# EAGLE design CRT_Control_Board (EAGLE 9.6.2)
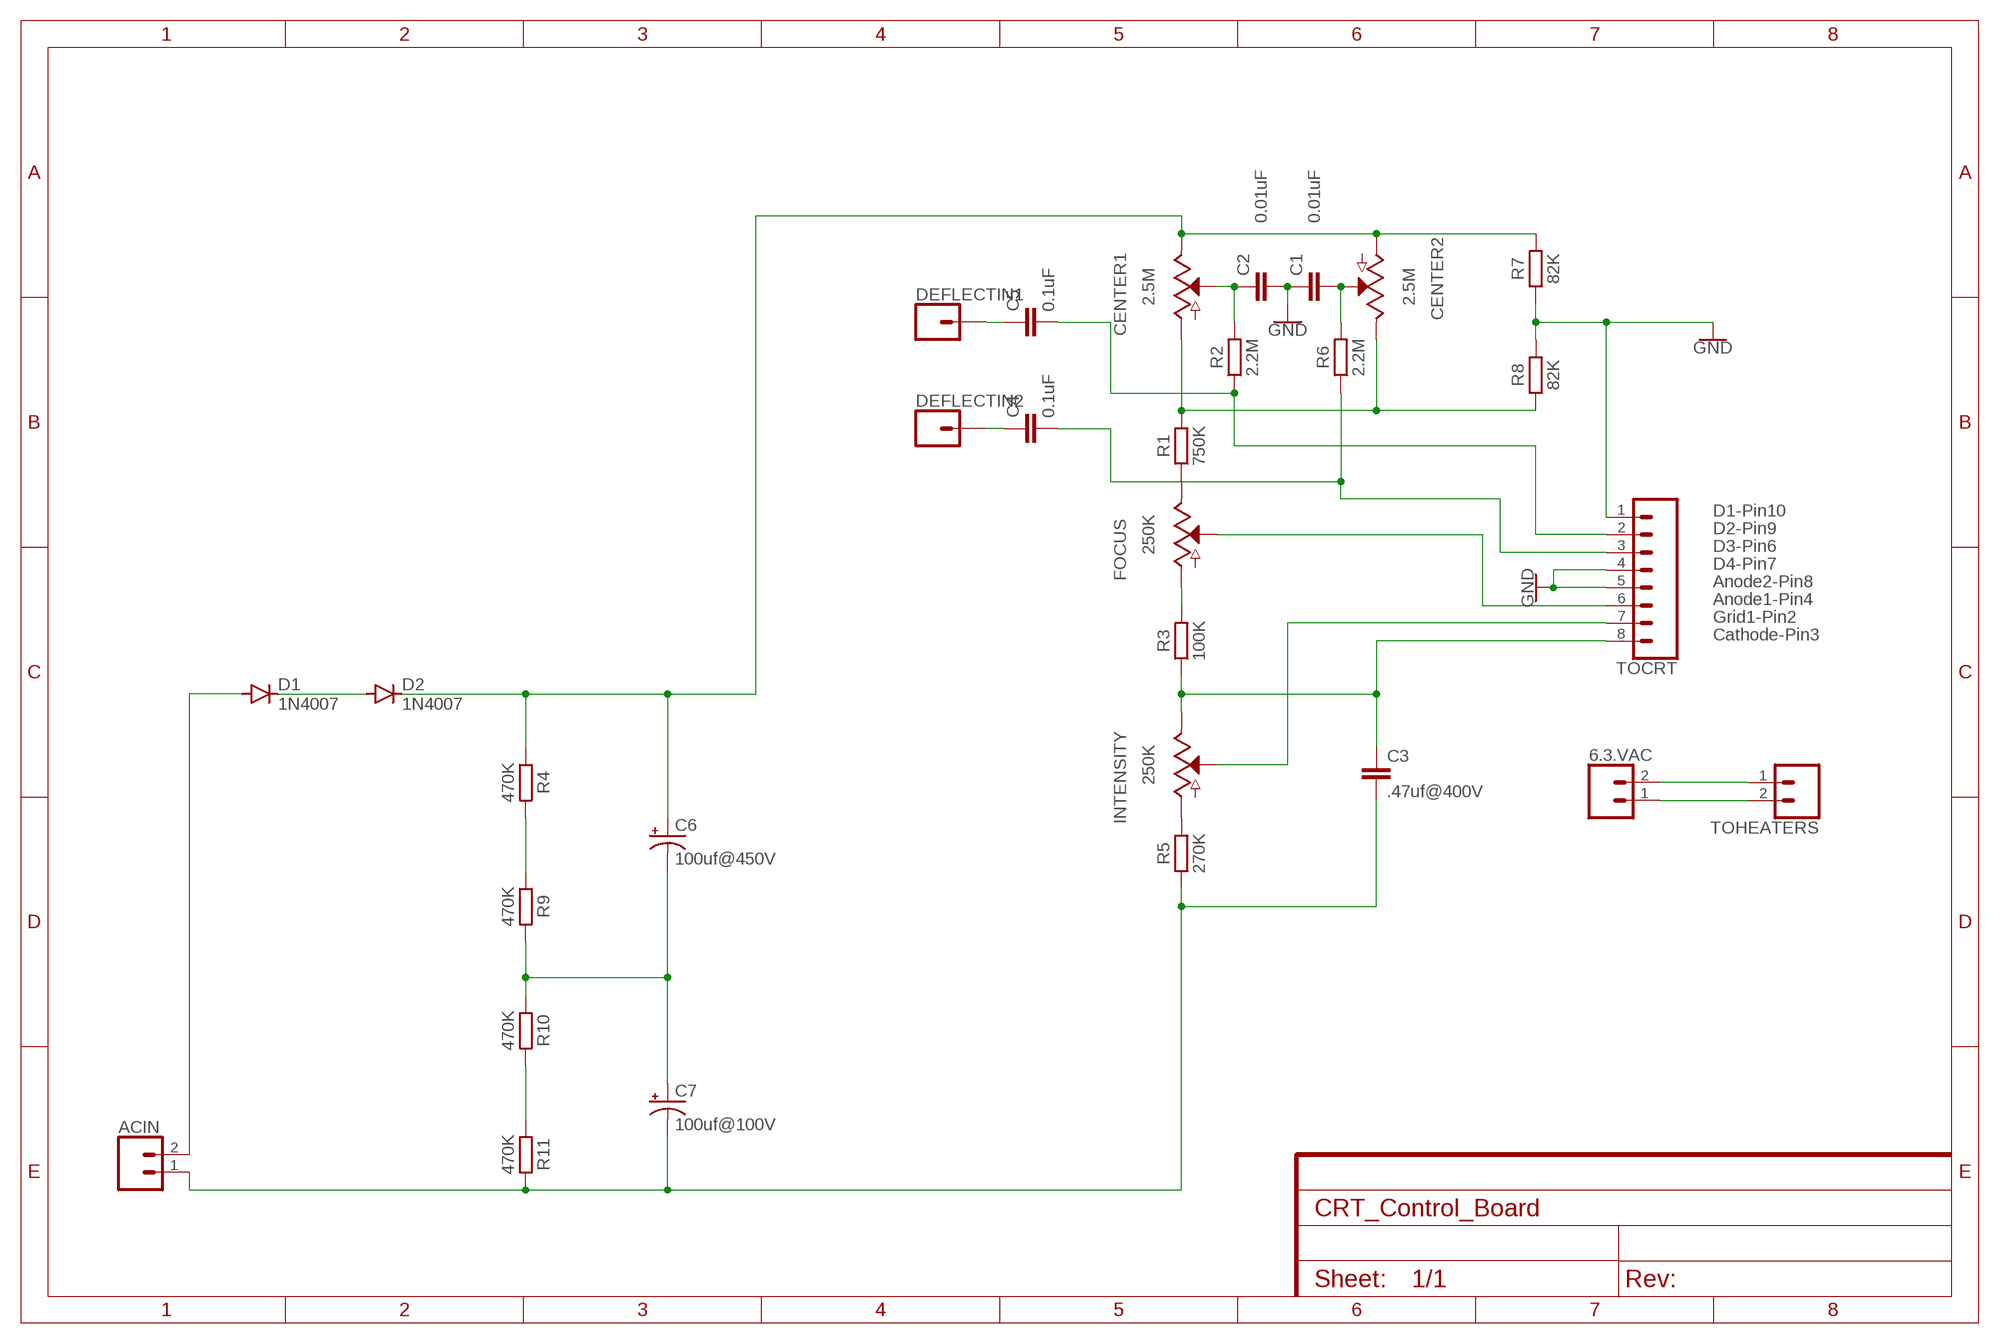
[diagram p0: schematic, sheet 1]

## Parts
6.3.VAC  CONN_02  [1X02]
ACIN  CONN_02  [1X02]
C1  0.01uF  0.1UF-KIT-EZ-50V-20%  [CAP-PTH-SMALL-KIT]
C2  0.01uF  0.1UF-KIT-EZ-50V-20%  [CAP-PTH-SMALL-KIT]
C3  .47uf@400V  0.1UF-KIT-EZ-50V-20%  [CAP-PTH-SMALL-KIT]
C4  0.1uF  0.1UF-KIT-EZ-50V-20%  [CAP-PTH-SMALL-KIT]
C5  0.1uF  0.1UF-KIT-EZ-50V-20%  [CAP-PTH-SMALL-KIT]
C6  100uf@450V  CPOL-USE5-6  [E5-6]
C7  100uf@100V  CPOL-USE5-6  [E5-6]
CENTER1  2.5M  POTENTIOMETER-PTH-9MM-1/20W-20%  [POT-PTH-ALPS]
CENTER2  2.5M  POTENTIOMETER-PTH-9MM-1/20W-20%  [POT-PTH-ALPS]
D1  1N4007  1N4004  [DO41-10]
D2  1N4007  1N4004  [DO41-10]
DEFLECTIN1  CONN_01PTH_LONGPAD  [1X01_LONGPAD]
DEFLECTIN2  CONN_01PTH_LONGPAD  [1X01_LONGPAD]
FOCUS  250K  POTENTIOMETER-PTH-9MM-1/20W-20%  [POT-PTH-ALPS]
INTENSITY  250K  POTENTIOMETER-PTH-9MM-1/20W-20%  [POT-PTH-ALPS]
R1  750K  R_AXIAL-11.7MM-PITCH  [RESAD1176W63L850D250B]
R2  2.2M  R_AXIAL-11.7MM-PITCH  [RESAD1176W63L850D250B]
R3  100K  R_AXIAL-11.7MM-PITCH  [RESAD1176W63L850D250B]
R4  470K  R_AXIAL-11.7MM-PITCH  [RESAD1176W63L850D250B]
R5  270K  R_AXIAL-11.7MM-PITCH  [RESAD1176W63L850D250B]
R6  2.2M  R_AXIAL-11.7MM-PITCH  [RESAD1176W63L850D250B]
R7  82K  R_AXIAL-11.7MM-PITCH  [RESAD1176W63L850D250B]
R8  82K  R_AXIAL-11.7MM-PITCH  [RESAD1176W63L850D250B]
R9  470K  R_AXIAL-11.7MM-PITCH  [RESAD1176W63L850D250B]
R10  470K  R_AXIAL-11.7MM-PITCH  [RESAD1176W63L850D250B]
R11  470K  R_AXIAL-11.7MM-PITCH  [RESAD1176W63L850D250B]
TOCRT  CONN_08LONGPADS  [1X08_LONGPADS]
TOHEATERS  CONN_02  [1X02]

## Nets
GND: C1.1 C2.2 R7.1 R8.2 TOCRT.1 TOCRT.4 TOCRT.5
N$1: C5.2 R2.1 TOCRT.2
N$2: 6.3.VAC.2 TOHEATERS.1
N$3: C6.+ CENTER1.P$1(E) CENTER2.P$3(A) D2.C R4.1 R7.2
N$4: INTENSITY.P$3(A) R5.2
N$5: C3.1 INTENSITY.P$1(E) R3.1 TOCRT.8
N$6: FOCUS.P$1(E) R1.1
N$7: FOCUS.P$3(A) R3.2
N$8: 6.3.VAC.1 TOHEATERS.2
N$9: C4.2 R6.1 TOCRT.3
N$10: C5.1 DEFLECTIN1.1
N$11: C2.1 CENTER1.P$2(S) R2.2
N$12: C1.2 CENTER2.P$2(S) R6.2
N$13: FOCUS.P$2(S) TOCRT.6
N$14: INTENSITY.P$2(S) TOCRT.7
N$15: C4.1 DEFLECTIN2.1
N$16: D1.C D2.A
N$17: ACIN.1 C3.2 C7.- R5.1 R11.2
N$18: R4.2 R9.1
N$19: C6.- C7.+ R9.2 R10.1
N$20: R10.2 R11.1
N$22: ACIN.2 D1.A
N$23: CENTER1.P$3(A) CENTER2.P$1(E) R1.2 R8.1

## Notes on the sheet
- D1-Pin10
- D2-Pin9
- D3-Pin6
- D4-Pin7
- Anode2-Pin8
- Anode1-Pin4
- Grid1-Pin2
- Cathode-Pin3

## Library data of the parts
6.3.VAC ACIN TOHEATERS = SparkFun-Connectors:CONN_02: Multi connection point. Often used as Generic Header-pin footprint for 0.1 inch spaced/style header connections On any of the 0.1 inch spaced packages, you can populate with these: Break Away Headers - Straight <https://www.sparkfun.com/products/116> (PRT-00116) Break Away Male Headers - Right Angle <https://www.sparkfun.com/products/553> (PRT-00553) Female Headers <https://www.sparkfun.com/products/115> (PRT-00115) Break Away Headers - Machine Pin <https://www.sparkfun.com/products/117> (PRT-00117) Break Away Female Headers - Swiss Machine Pin <https://www.sparkfun.com/products/743> (PRT-00743) For SCREWTERMINALS and SPRING TERMINALS visit here: Screw Terimnals on SparkFun.com <https://www.sparkfun.com/search/results?term=Screw+Terminals> (5mm/3.5mm/2.54mm spacing) This device is also useful as a general connection point to wire up your design to another part of your project. Our various solder wires solder well into these plated through hole pads. Hook-Up Wire - Assortment (Stranded, 22 AWG) <https://www.sparkfun.com/products/11375> (PRT-11375) Hook-Up Wire - Assortment (Solid Core, 22 AWG) <https://www.sparkfun.com/products/11367> (PRT-11367) View the entire wire category on our website here <https://www.sparkfun.com/categories/141> Special notes: Molex polarized connector foot print use with: PRT-08233 with associated crimp pins and housings. 2.54_SCREWTERM for use with PRT-10571. 3.5mm Screw Terminal footprints for PRT-08084 5mm Screw Terminal footprints for use with PRT-08432
C1-C3 = SparkFun-Capacitors:0.1UF: 0.1µF ceramic capacitors A capacitor is a passive two-terminal electrical component used to store electrical energy temporarily in an electric field.; PROD_ID: CAP-08370; VALUE: 0.1uF
C4 C5 = SparkFun-Capacitors:0.1UF: 0.1µF ceramic capacitors A capacitor is a passive two-terminal electrical component used to store electrical energy temporarily in an electric field.; PROD_ID: CAP-08370
C6 C7 = rcl:CPOL-US: POLARIZED CAPACITOR, American symbol; SPICEPREFIX: C
CENTER1 CENTER2 FOCUS INTENSITY = SparkFun-Resistors:POTENTIOMETER: Potentiometer (Pot) Three-terminal potentiometers, with an adjustable wiper and two adjustable resistors. A pot can be used to create a configurable voltage divider, or as a variable resistor. Variants ALPS_POT and ALPS_POT_KIT - PTH, breadboard compatible, 9mm square pots Rotary Potentiometer - Linear (10k ohm) <https://www.sparkfun.com/products/9288> (COM-09288) The KIT variant exposes copper on only one side of the PTH pad, so the part can only be assembled on one side of the PCB. Useful for beginner soldering kits.; PROD_ID: RES-09177; SF_SKU: COM-09288; VALUE: 10k
D1 D2 = diode:1N4004: DIODE general purpose rectifier, 1 A
DEFLECTIN1 DEFLECTIN2 = SparkFun-Connectors:CONN_01: Single connection point. Often used as Generic Header-pin footprint for 0.1 inch spaced/style header connections On any of the 0.1 inch spaced packages, you can populate with these: Break Away Headers - Straight <https://www.sparkfun.com/products/116> (PRT-00116) Break Away Male Headers - Right Angle <https://www.sparkfun.com/products/553> (PRT-00553) Female Headers <https://www.sparkfun.com/products/115> (PRT-00115) Break Away Headers - Machine Pin <https://www.sparkfun.com/products/117> (PRT-00117) Break Away Female Headers - Swiss Machine Pin <https://www.sparkfun.com/products/743> (PRT-00743) This device is also useful as a general connection point to wire up your design to another part of your project. Our various solder wires solder well into these plated through hole pads. Hook-Up Wire - Assortment (Stranded, 22 AWG) <https://www.sparkfun.com/products/11375> (PRT-11375) Hook-Up Wire - Assortment (Solid Core, 22 AWG) <https://www.sparkfun.com/products/11367> (PRT-11367) View the entire wire category on our website here <https://www.sparkfun.com/categories/141> Special notes: SMTSO-256-ET is a "flush mount" nut for a 4-40 screw. We mostly use this on specialty testbeds; it is a nice way to connect hardware to your PCB at an adjustable hieght. Also note, the SNAP packages are for using a snappable style connector. We sell a baggie of snaps and they are also used on two LilyPad designs: Snap Assortment - 30 pack (male and female) <https://www.sparkfun.com/products/11347> (DEV-11347) LilyPad Arduino SimpleSnap <https://www.sparkfun.com/products/10941> (DEV-10941) LilyPad SimpleSnap Protoboard <https://www.sparkfun.com/products/10940> (DEV-10940)
R1-R11 = Resistor:R: Resistor Fixed - Generic; CATEGORY: Resistor; SUB-CATEGORY: Fixed
TOCRT = SparkFun-Connectors:CONN_08: Multi connection point. Often used as Generic Header-pin footprint for 0.1 inch spaced/style header connections On any of the 0.1 inch spaced packages, you can populate with these: Break Away Headers - Straight <https://www.sparkfun.com/products/116> (PRT-00116) Break Away Male Headers - Right Angle <https://www.sparkfun.com/products/553> (PRT-00553) Female Headers <https://www.sparkfun.com/products/115> (PRT-00115) Break Away Headers - Machine Pin <https://www.sparkfun.com/products/117> (PRT-00117) Break Away Female Headers - Swiss Machine Pin <https://www.sparkfun.com/products/743> (PRT-00743) Arduino Stackable Header - 8 Pin <https://www.sparkfun.com/products/9279> (PRT-09279) For SCREWTERMINALS and SPRING TERMINALS visit here: Screw Terimnals on SparkFun.com <https://www.sparkfun.com/search/results?term=Screw+Terminals> (5mm/3.5mm/2.54mm spacing) This device is also useful as a general connection point to wire up your design to another part of your project. Our various solder wires solder well into these plated through hole pads. Hook-Up Wire - Assortment (Stranded, 22 AWG) <https://www.sparkfun.com/products/11375> (PRT-11375) Hook-Up Wire - Assortment (Solid Core, 22 AWG) <https://www.sparkfun.com/products/11367> (PRT-11367) View the entire wire category on our website here <https://www.sparkfun.com/categories/141> Special notes: Molex polarized connector foot print use with SKU : PRT-08231 with associated crimp pins and housings. 1MM SMD Version SKU: PRT-10208 NOTES ON THE VARIANTS LOCK and LOCK_LONGPADS... This footprint was designed to help hold the alignment of a through-hole component (i.e. 6-pin header) while soldering it into place. You may notice that each hole has been shifted either up or down by 0.005 of an inch from it's more standard position (which is a perfectly straight line). This slight alteration caused the pins (the squares in the middle) to touch the edges of the holes. Because they are alternating, it causes a "brace" to hold the component in place. 0.005 has proven to be the perfect amount of "off-center" position when using our standard breakaway headers. Although looks a little odd when you look at the bare footprint, once you have a header in there, the alteration is very hard to notice. Also,if you push a header all the way into place, it is covered up entirely on the bottom side.

## Board
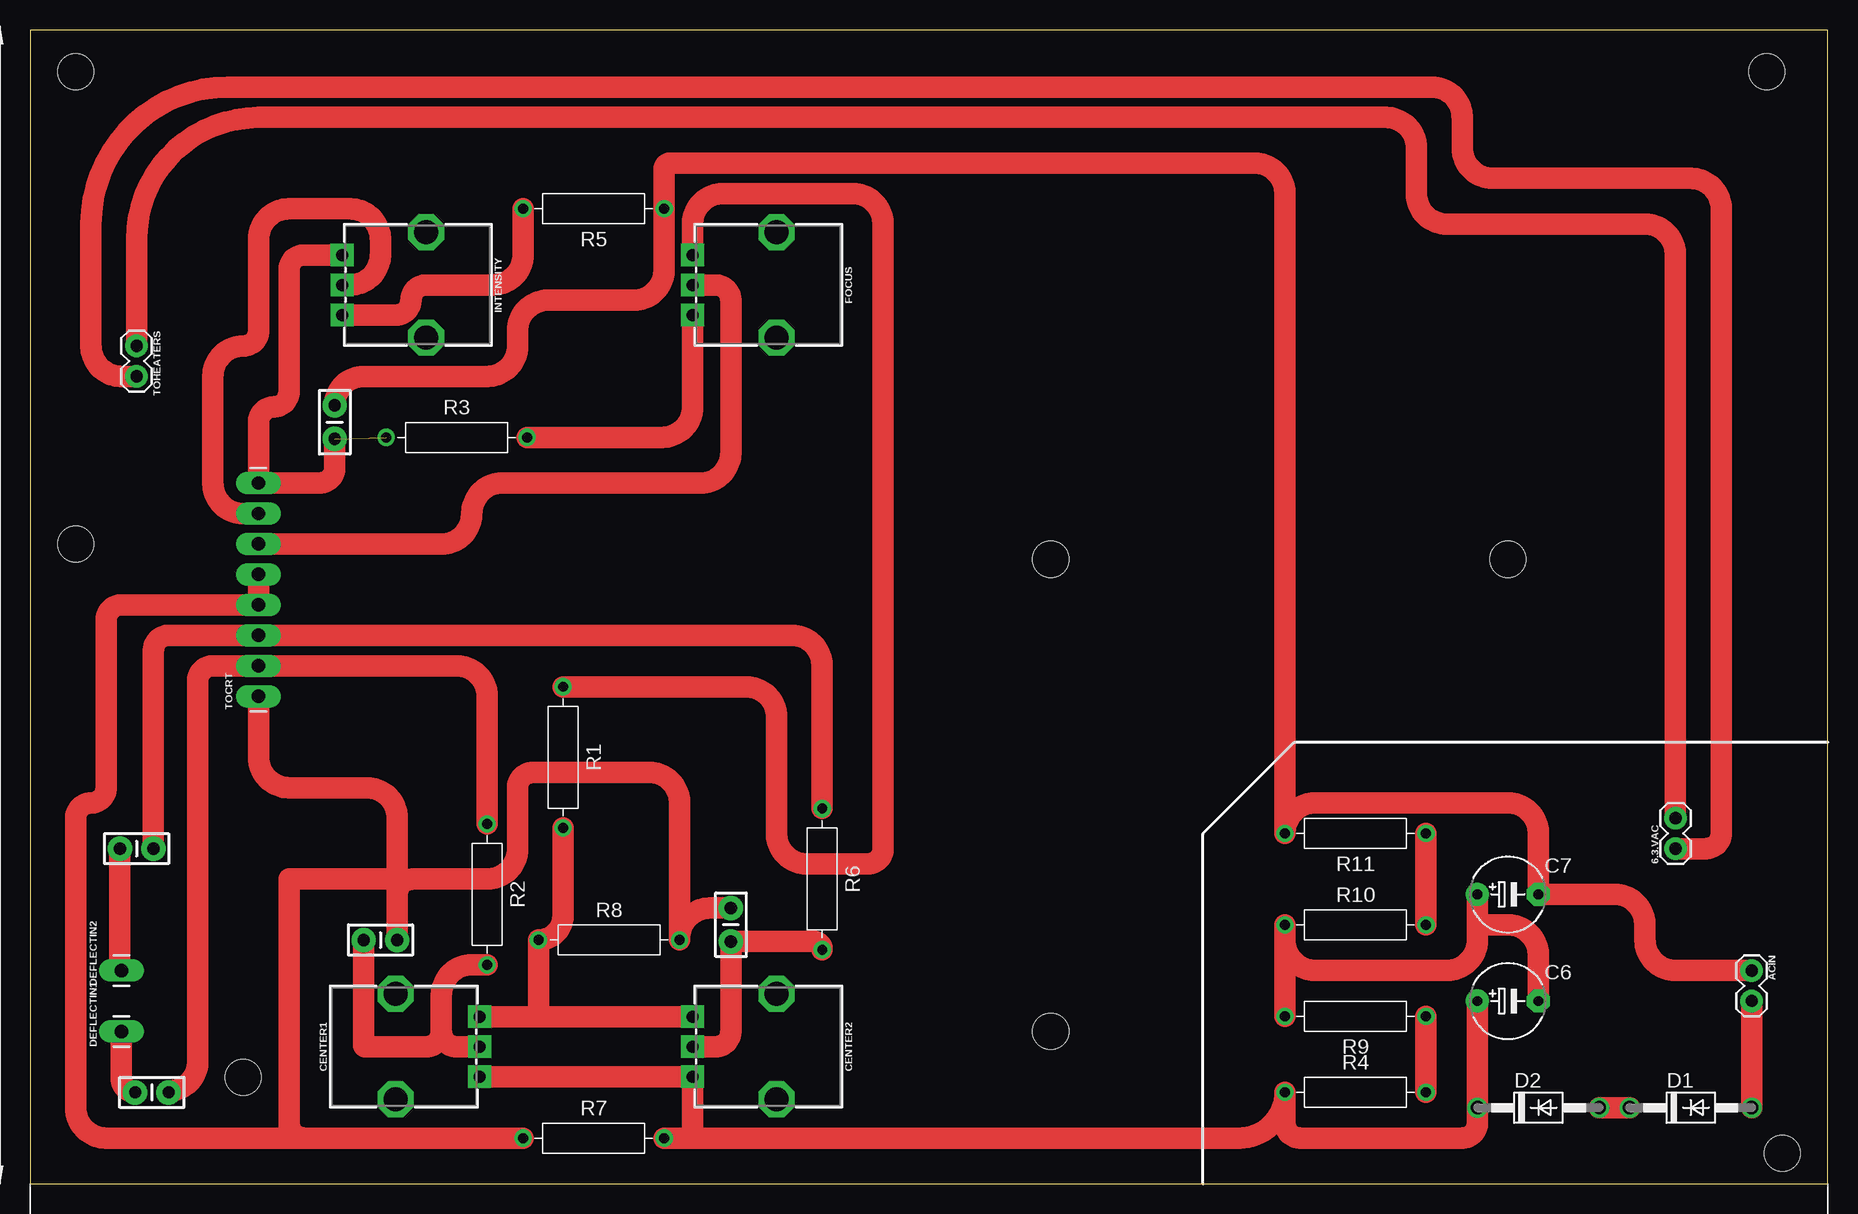
[diagram p1: board, top side]

Size 149.84 x 96.19 mm. Coordinates in mm from the lower left corner, seen from the top.
Outline: 0,0 149.84,0 149.84,96.19 0,96.19 0,0
Copper layers (1*16): Top 0.035mm / dielectric 1.5mm / Bottom 0.035mm
Design rules "default": minimum track width 6mil, minimum drill 0.35mm, track to track 6mil, track to pad 6mil, pad to pad 6mil, via to via 6mil, smd to smd 6mil, copper to edge 40mil, drill to drill 6mil, minimum pad ring 10mil, minimum via ring 8mil, stop-mask expansion 4mil, vias tented up to drill 0mil, thermal gap 10mil
Holes 3 mm at 3.81,92.71 3.81,53.34 144.78,92.71 123.19,52.07 85.09,52.07 85.09,12.7 17.78,8.89 146.05,2.54

### Footprints (pad centres in the part's own frame; a part is rotated, then mirrored left to right if it is on the bottom)
1X02 = drill 1.016 pad 1.88: 1 0,0; 2 2.54,0
CAP-PTH-SMALL-KIT = drill 1.016 pad 2.032: 1 -1.397,0; 2 1.397,0
E5-6 = drill 0.813 pad 1.905: + -2.54,0 | drill 0.813 pad 1.905 octagon: - 2.54,0
POT-PTH-ALPS = drill 1 pad 1.88 square: P$1 7,-2.5; P$2 7,0; P$3 7,2.5 | drill 2 octagon: P$4 0,-4.4; P$5 0,4.4
DO41-10 = drill 1.118: A 5.08,0; C -5.08,0
1X01_LONGPAD = drill 1.118 pad 1.88 long: 1 0,0
RESAD1176W63L850D250B = drill 0.83 pad 1.43: 1 -5.88,0; 2 5.88,0
1X08_LONGPADS = drill 1.118 pad 1.88 long: 1 0,0; 2 2.54,0; 3 5.08,0; 4 7.62,0; 5 10.16,0; 6 12.7,0; 7 15.24,0; 8 17.78,0

### Placement (x,y rotation side)
6.3.VAC  137.16,27.94 90 top
ACIN  143.51,17.78 270 top
C1  58.42,21.59 270 top
C2  29.21,20.32 0 top
C3  25.4,63.5 90 top
C4  8.89,27.94 0 top
C5  10.16,7.62 0 top
C6  123.19,15.24 0 top
C7  123.19,24.13 0 top
CENTER1  30.48,11.43 0 top
CENTER2  62.23,11.43 180 top
D1  138.43,6.35 0 top
D2  125.73,6.35 0 top
DEFLECTIN1  7.62,12.7 90 top
DEFLECTIN2  7.62,17.78 90 top
FOCUS  62.23,74.93 180 top
INTENSITY  33.02,74.93 180 top
R1  44.45,35.56 270 top
R2  38.1,24.13 270 top
R3  35.56,62.23 0 top
R4  110.49,7.62 0 top
R5  46.99,81.28 180 top
R6  66.04,25.4 270 top
R7  46.99,3.81 0 top
R8  48.26,20.32 0 top
R9  110.49,13.97 180 top
R10  110.49,21.59 0 top
R11  110.49,29.21 180 top
TOCRT  19.05,40.64 90 top
TOHEATERS  8.89,69.85 270 top

### Tracks (layer width: path | path; a pad name or v marks a point on that pad's centre or on a via)
GND
  Top 1.778: 30.61,25.4 C2.2 30.61,24.13 arc-90 31.88,25.4 38.1,25.4 arc90 40.64,27.94 40.64,33.02 arc-90 41.91,34.29 51.6,34.29 arc-90 54.14,31.75 R8.2 54.14,20.45 arc-90 56.68,22.99 C1.1 | 30.61,25.4 30.61,30.48 arc90 28.07,33.02 21.59,33.02 arc-90 19.05,35.56 TOCRT.1 | 30.61,25.4 21.59,25.4 21.59,5.08 arc90 22.86,3.81 | 22.86,3.81 R7.1 | TOCRT.5 TOCRT.4 7.62,48.26 arc90 6.35,46.99 6.35,33.02 arc-90 5.08,31.75 arc90 3.81,30.48 3.81,6.35 arc90 6.35,3.81 22.86,3.81
N$1
  Top 1.778: C5.2 11.56,7.75 arc90 13.97,10.16 13.97,41.91 arc-90 15.24,43.18 TOCRT.2 35.56,43.18 arc-90 38.1,40.64 R2.1
N$2
  Top 1.778: TOHEATERS.1 8.89,78.74 arc-90 19.05,88.9 113.03,88.9 arc-90 115.57,86.36 115.57,82.55 arc90 118.11,80.01 134.62,80.01 arc-90 137.16,77.47 6.3.VAC.2
N$3
  Top 1.778: C6.+ D2.C 120.65,5.08 arc-90 119.38,3.81 105.88,3.81 arc-90 104.61,5.08 R4.1 arc-90 100.8,3.81 54.61,3.81 | CENTER1.P$1 CENTER2.P$3 55.23,4.43 arc-90 54.61,3.81 | R7.2 54.61,3.81
N$4
  Top 1.778: INTENSITY.P$3 30.52,72.43 arc90 31.75,73.66 arc-90 33.02,74.93 38.57,74.93 arc90 41.11,77.47 R5.2
N$5  (1 unrouted)
  Top 1.778: INTENSITY.P$1 22.82,77.43 arc90 21.59,76.2 21.59,66.04 arc-90 20.32,64.77 arc90 19.05,63.5 TOCRT.8 24.13,58.42 arc90 25.4,59.69 C3.1
N$6
  Top 1.778: R1.1 59.69,41.44 arc-90 62.23,38.9 62.23,29.21 arc90 64.77,26.67 69.85,26.67 arc90 71.12,27.94 71.12,80.01 arc90 68.58,82.55 57.77,82.55 arc90 55.23,80.01 FOCUS.P$1
N$7
  Top 1.778: FOCUS.P$3 55.23,64.77 arc-90 52.69,62.23 R3.2
N$8
  Top 1.778: TOHEATERS.2 7.62,67.31 arc-90 5.08,69.85 5.08,80.01 arc-90 16.51,91.44 116.84,91.44 arc-90 119.38,88.9 119.38,86.36 arc90 121.92,83.82 138.43,83.82 arc-90 140.97,81.28 140.97,29.21 arc-90 139.7,27.94 6.3.VAC.1
N$9
  Top 1.778: C4.2 10.29,44.45 arc-90 11.56,45.72 TOCRT.3 63.5,45.72 arc-90 66.04,43.18 R6.1
N$10
  Top 1.778: DEFLECTIN1.1 7.62,8.76 arc90 C5.1
N$11
  Top 1.778: R2.2 36.83,18.25 arc90 34.29,15.71 34.29,12.7 | 34.29,12.7 arc90 35.56,11.43 CENTER1.P$2 | 34.29,12.7 arc-90 33.02,11.43 27.94,11.43 arc-90 27.81,11.56 C2.1
N$12
  Top 1.778: CENTER2.P$2 57.15,11.43 arc90 58.42,12.7 C1.2 65.37,20.19 arc-90 R6.2
N$13
  Top 1.778: FOCUS.P$2 57.15,74.93 arc-90 58.42,73.66 58.42,60.96 arc-90 55.88,58.42 39.37,58.42 arc90 36.83,55.88 arc-90 34.29,53.34 TOCRT.6
N$14
  Top 1.778: TOCRT.7 17.78,55.88 arc-90 15.24,58.42 15.24,67.31 arc-90 17.78,69.85 arc90 19.05,71.12 19.05,78.74 arc-90 21.59,81.28 26.67,81.28 arc-90 29.21,78.74 29.21,77.47 arc-90 26.67,74.93 INTENSITY.P$2
N$15
  Top 1.778: C4.1 7.49,17.91 arc-90 DEFLECTIN2.1
N$16
  Top 1.778: D1.C D2.A
N$17
  Top 1.778: ACIN.1 137.16,17.78 arc-90 134.62,20.32 134.62,21.59 arc90 132.08,24.13 C7.- 125.73,29.21 arc90 123.19,31.75 107.15,31.75 arc90 R11.2 104.61,82.55 arc90 102.07,85.09 53.34,85.09 arc90 52.87,84.62 R5.1 52.87,76.2 arc-90 50.33,73.66 43.18,73.66 arc90 40.64,71.12 40.64,69.85 arc-90 38.1,67.31 27.81,67.31 arc90 C3.2
N$18
  Top 1.778: R4.2 R9.1
N$19
  Top 1.778: R9.2 R10.1 104.61,20.32 arc90 107.15,17.78 118.11,17.78 arc90 120.65,20.32 120.65,21.59 | C7.+ 120.65,21.59 | C6.- 125.73,19.05 arc90 123.19,21.59 120.65,21.59
N$20
  Top 1.778: R10.2 R11.1
N$22
  Top 1.778: ACIN.2 D1.A
N$23
  Top 1.778: CENTER2.P$1 41.91,13.93 | 41.91,13.93 CENTER1.P$3 | 41.91,13.93 arc90 42.38,14.4 R8.1 arc90 44.45,22.39 R1.2